# Altium schematic sheet Indicators.SchDoc
size A; SheetNumber: 7; SheetTotal: 7
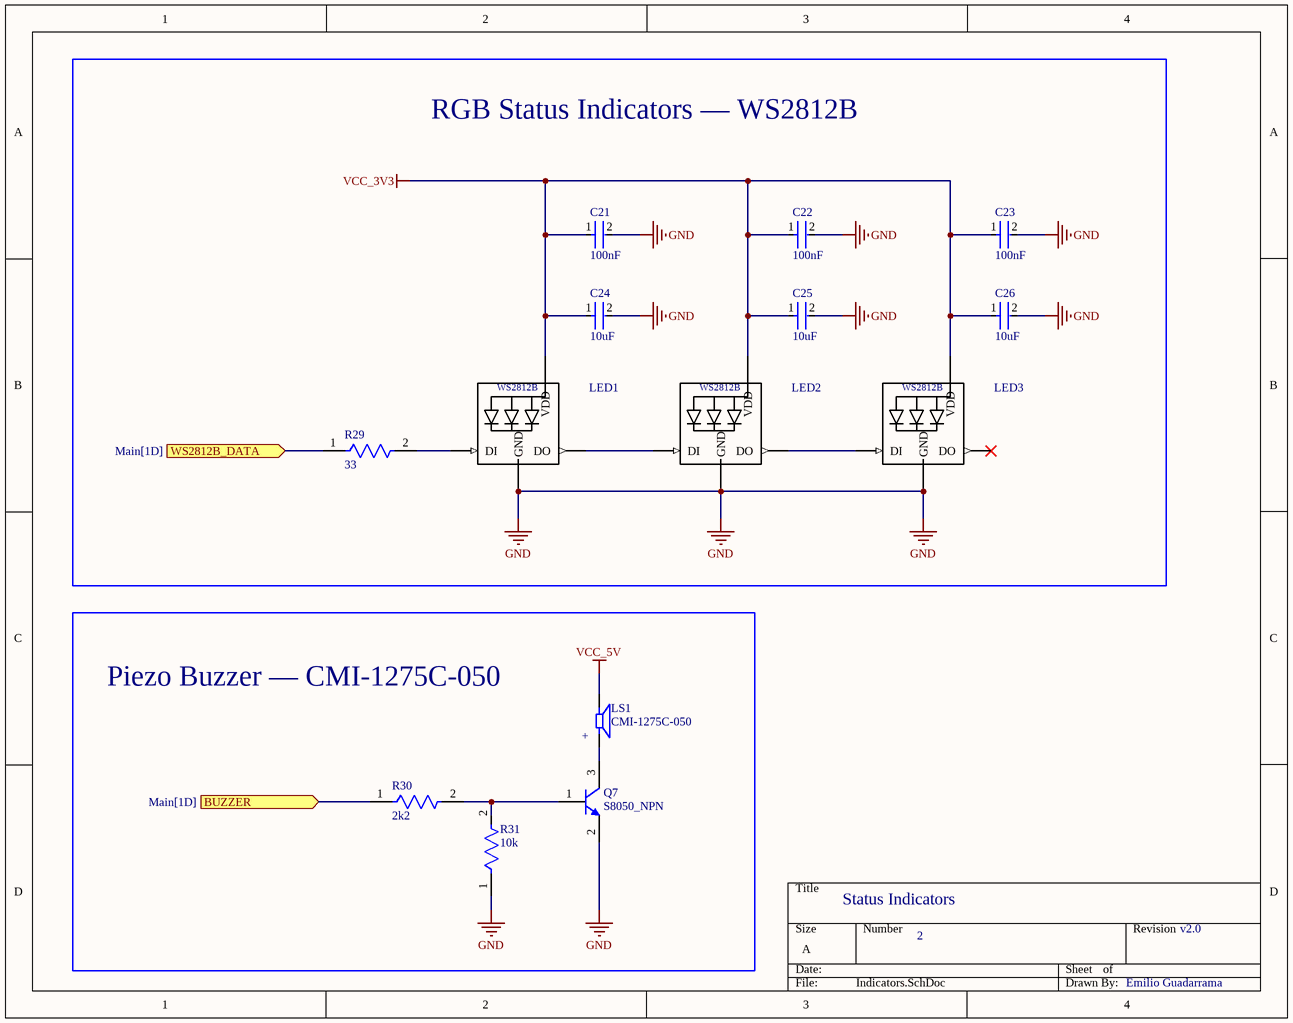
[diagram p0: Indicators.SchDoc]

## Parts
C21  100nF  [FP-C0805C-DN-MFG]
C22  100nF  [FP-C0805C-DN-MFG]
C23  100nF  [FP-C0805C-DN-MFG]
C24  10uF  [FP-C0805C-DN-MFG]
C25  10uF  [FP-C0805C-DN-MFG]
C26  10uF  [FP-C0805C-DN-MFG]
LED1  WS2812B  [*WS2812B_WS2812B(Primary)]  (value not drawn)
LED2  WS2812B  [*WS2812B_WS2812B(Primary)]  (value not drawn)
LED3  WS2812B  [*WS2812B_WS2812B(Primary)]  (value not drawn)
LS1  CMI-1275C-050  [CUI_CMI-1275C-050]
Q7  S8050_NPN  [PCBComponent_1]
R29  33  [FP-MCT0603-IPC_A]
R30  2k2  [FP-MCT0603-IPC_A]
R31  10k  [FP-MCT0603-IPC_A]

## Blocks framed on the sheet
RGB Status Indicators — WS2812B: C21-C26 LED1-LED3 R29
Piezo Buzzer — CMI-1275C-050: LS1 Q7 R30 R31

## Ports
BUZZER (in, see Main[1D]), WS2812B_DATA (in, see Main[1D])

## Nets
GND: C21.2 C22.2 C23.2 C24.2 C25.2 C26.2 LED1.3-GND(GND) LED2.3-GND(GND) LED3.3-GND(GND) Q7.2(E) R31.1
VCC_3V3: C21.1 C22.1 C23.1 C24.1 C25.1 C26.1 LED1.1-VDD(VDD) LED2.1-VDD(VDD) LED3.1-VDD(VDD)
VCC_5V: LS1.N
BUZZER: R30.1 ; port BUZZER
WS2812B_DATA: R29.1 ; port WS2812B_DATA
NetLED1_2-DOUT: LED1.2-DOUT(DO) LED2.4-DIN(DI)
NetLED1_4-DIN: LED1.4-DIN(DI) R29.2
NetLED2_2-DOUT: LED2.2-DOUT(DO) LED3.4-DIN(DI)
NetLS1_P: LS1.P Q7.3(C)
NetQ7_1: Q7.1(B) R30.2 R31.2

Not connected (* = marked no-connect by the designer): LED3 2-DOUT(DO)*

## Notes on the sheet
- Status Indicators
- 2
- v2.0
- Emilio Guadarrama
- (in symbol CMI-1275C-050) +

## Library data of the parts
C21-C26 = CMP-2007-00279-2: CAP CER 0.1UF 50V X7R 0805; Manufacturer Part Number: C0805C104K5RACTU; Manufacturer: KEMET; Value: 0.10 μF; Tolerance: 0.1; Temperature Coefficient: 30ppm/°C; Material: Ceramic; Device Class L2: Capacitors; Temperature Range Low: -55°C; Voltage Rating: 50 V; Digikey Description: CAP CER 0.1UF 50V X7R 0805; Category: Cap; ComponentLink2Description: Datasheet; Octopart: https://octopart.com/c0805c104k5ractu-kemet-143926; RoHS: TRUE; ComponentLink2URL: https://content.kemet.com/datasheets/KEM_C1003_C0G_SMD.pdf; Temperature Characteristic: X7R; Temperature: -55°C to +125°C; Height: 0.88mm; Temperature Range High: +125°C; Device Class L1: Passive Components; Automotive: No; Lead Free: Yes; Ipc Land Pattern Name: CAPC200125X78; Device Class L3: Ceramic Capacitors; Mouser Description: Cap Ceramic 0.1uF 50V X7R 10% SMD 2.0 x 1.2 mm 125 C Paper T/R; Capacitance: 0.10 μF; Package: C0805C-DN
LED1-LED3 = WS2812B: Intelligent control LED integrated light source; MF: Worldsemi; SnapEDA_Link: https://www.snapeda.com/parts/WS2812B/Worldsemi/view-part/?ref=snap; Package: None; MP: WS2812B; Check_prices: https://www.snapeda.com/parts/WS2812B/Worldsemi/view-part/?ref=eda; Value: *
LS1 = CMI-1275C-050: 12 mm, 5 Vdc, 90 dB, 3.1 kHz, Through Hole, Magnetic Audio Indicator Buzzer; MF: Same Sky; SnapEDA_Link: https://www.snapeda.com/parts/CMI-1275C-050/Same+Sky/view-part/?ref=snap; Package: None; Value: *; MP: CMI-1275C-050; Check_prices: https://www.snapeda.com/parts/CMI-1275C-050/Same+Sky/view-part/?ref=eda
Q7 = Component_1
R29-R31 = CMP-02407-011165-1: RES SMD 100 OHM 1% 1/8W 0603; Temperature Coefficient: 25ppm/°C; Resistance: 20kR; Power Rating: 125mW; Tolerance: 0.1%; Voltage Rating: 75V; Length: 1.55mm; Case Code (Imperial): 0603; Case/Package: 0603; Construction: Rectangular; Package Quantity: 1000; Number of Terminations: 2; Termination: SMD/SMT; Resistor Type: Thin Film; Features: Automotive AEC-Q200; Series: MCT 0603 - Precision; Max Operating Temperature: 155°C; Depth: 0.85mm; Max Power Dissipation: 125mW; Min Operating Temperature: -55°C; Width: 0.033inch; Case Code (Metric): 1608; Packaging: Tape and Reel; Weight: 6.7E-05oz; Military Standard: Not; Height: 0.022inch